# EAGLE design JackPots (EAGLE 6.6.0)
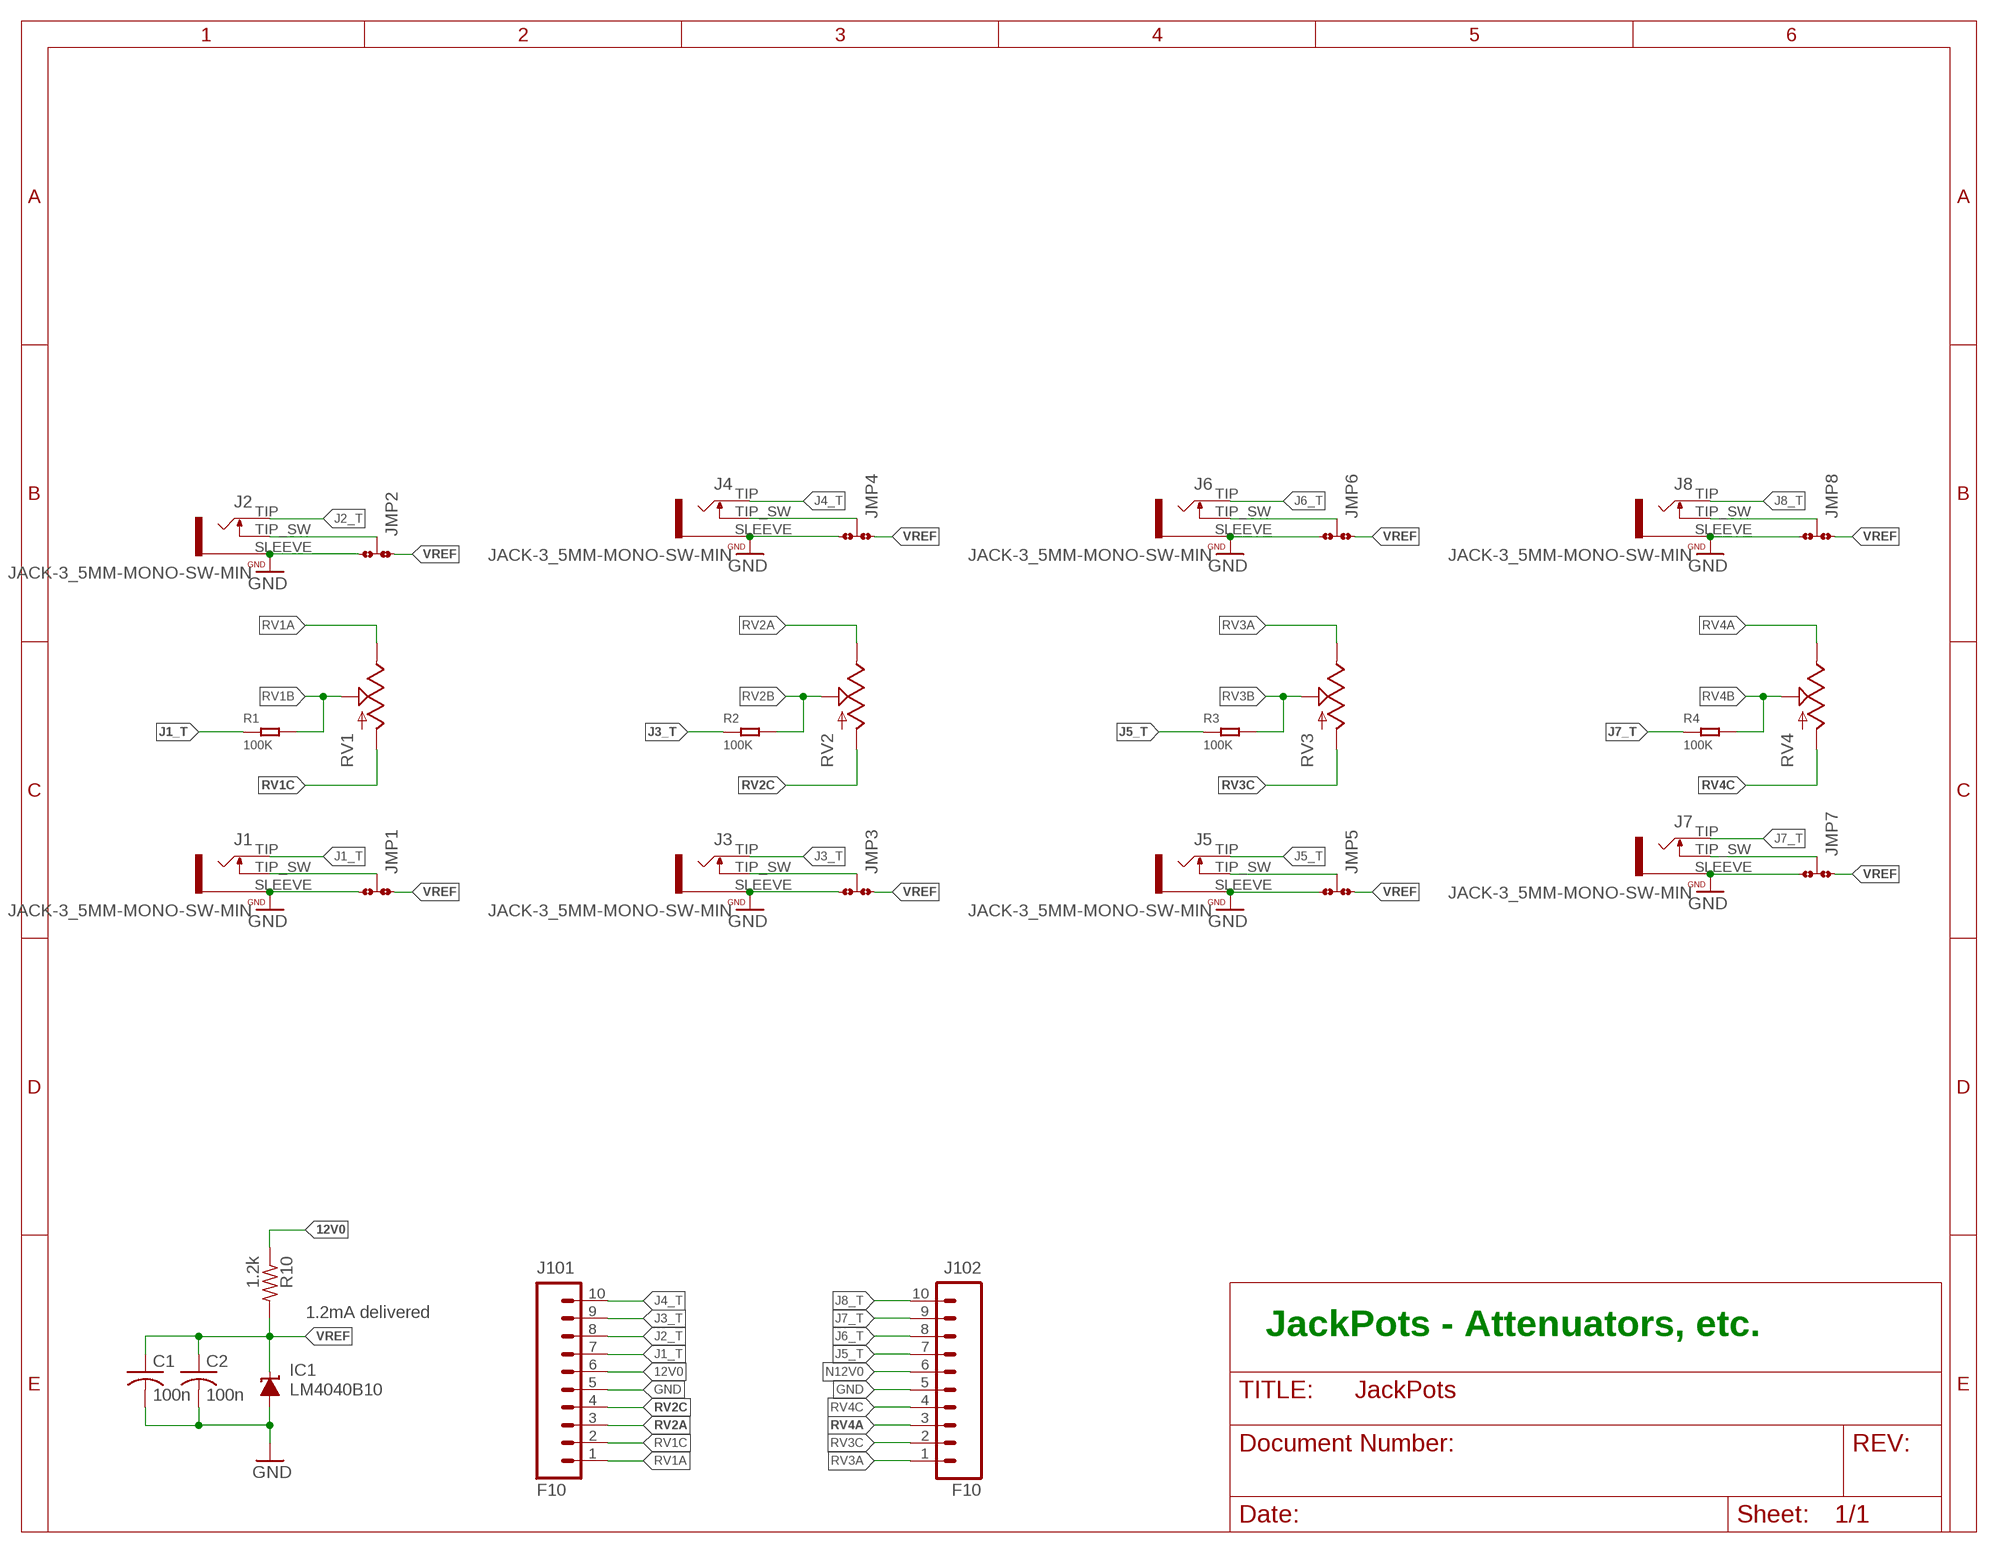
[diagram p0: schematic, sheet 1]

## Parts
C1  100n  C-USC0603  [C0603]
C2  100n  C-USC0603  [C0603]
IC1  LM4040B10  LM4041B12DBZ  [DBZ_R-PDSO-G3]
J1  JACK-3_5MM-MONO-SW-MIN  [WQP_PJ301M-MIN]
J2  JACK-3_5MM-MONO-SW-MIN  [WQP_PJ301M-MIN]
J3  JACK-3_5MM-MONO-SW-MIN  [WQP_PJ301M-MIN]
J4  JACK-3_5MM-MONO-SW-MIN  [WQP_PJ301M-MIN]
J5  JACK-3_5MM-MONO-SW-MIN  [WQP_PJ301M-MIN]
J6  JACK-3_5MM-MONO-SW-MIN  [WQP_PJ301M-MIN]
J7  JACK-3_5MM-MONO-SW-MIN  [WQP_PJ301M-MIN]
J8  JACK-3_5MM-MONO-SW-MIN  [WQP_PJ301M-MIN]
J101  F10  M10SILK_FEMALE_PTH  [1X10_OCTO]
J102  F10  M10SILK_FEMALE_PTH  [1X10_OCTO]
JMP1  JMP-3-NO-0603  [JMP-3-NO-0603]
JMP2  JMP-3-NO-0603  [JMP-3-NO-0603]
JMP3  JMP-3-NO-0603  [JMP-3-NO-0603]
JMP4  JMP-3-NO-0603  [JMP-3-NO-0603]
JMP5  JMP-3-NO-0603  [JMP-3-NO-0603]
JMP6  JMP-3-NO-0603  [JMP-3-NO-0603]
JMP7  JMP-3-NO-0603  [JMP-3-NO-0603]
JMP8  JMP-3-NO-0603  [JMP-3-NO-0603]
R1  100K  SMD-RES-100K-1%-1/10W(0603)  [R0603]
R2  100K  SMD-RES-100K-1%-1/10W(0603)  [R0603]
R3  100K  SMD-RES-100K-1%-1/10W(0603)  [R0603]
R4  100K  SMD-RES-100K-1%-1/10W(0603)  [R0603]
R10  1.2k  R-US_R0603  [R0603]
RV1  POT  [ALPS_POT]
RV2  POT  [ALPS_POT]
RV3  POT  [ALPS_POT]
RV4  POT  [ALPS_POT]

## Nets
12V0: J101.6 R10.1
GND: C1.2 C2.2 IC1.2(A) J1.SLEEVE J2.SLEEVE J3.SLEEVE J4.SLEEVE J5.SLEEVE J6.SLEEVE J7.SLEEVE J8.SLEEVE J101.5 J102.5 JMP1.3 JMP2.3 JMP3.3 JMP4.3 JMP5.3 JMP6.3 JMP7.3 JMP8.3
J1_T: J1.TIP J101.7 R1.1
J1_TN: J1.TIP_SW JMP1.2
J2_T: J2.TIP J101.8
J2_TN: J2.TIP_SW JMP2.2
J3_T: J3.TIP J101.9 R2.1
J3_TN: J3.TIP_SW JMP3.2
J4_T: J4.TIP J101.10
J4_TN: J4.TIP_SW JMP4.2
J5_T: J5.TIP J102.7 R3.1
J5_TN: J5.TIP_SW JMP5.2
J6_T: J6.TIP J102.8
J6_TN: J6.TIP_SW JMP6.2
J7_T: J7.TIP J102.9 R4.1
J7_TN: J7.TIP_SW JMP7.2
J8_T: J8.TIP J102.10
J8_TN: J8.TIP_SW JMP8.2
N12V0: J102.6
RV1A: J101.1 RV1.P$1
RV1B: R1.2 RV1.P$2
RV1C: J101.2 RV1.P$3
RV2A: J101.3 RV2.P$1
RV2B: R2.2 RV2.P$2
RV2C: J101.4 RV2.P$3
RV3A: J102.1 RV3.P$1
RV3B: R3.2 RV3.P$2
RV3C: J102.2 RV3.P$3
RV4A: J102.3 RV4.P$1
RV4B: R4.2 RV4.P$2
RV4C: J102.4 RV4.P$3
VREF: C1.1 C2.1 IC1.1(C) JMP1.1 JMP2.1 JMP3.1 JMP4.1 JMP5.1 JMP6.1 JMP7.1 JMP8.1 R10.2

## Notes on the sheet
- 1.2mA delivered
- JackPots - Attenuators, etc.

## Library data of the parts
C1 C2 = rcl:C-US: CAPACITOR, American symbol
IC1 = texas:LM4041: PRECISION MICROPOWER SHUNT VOLTAGE REFERENCE Source: http://focus.ti.com/lit/ds/slcs146e/slcs146e.pdf
J1-J8 = halcyonmod_Connectors:JACK-3_5MM-MONO-SW: Jack, 3.5mm, RIght Angle, Though-Hole
J101 J102 = oXo_Connectors:M10: Header 10 Standard 10-pin 0.1" header. Use with straight break away headers (SKU : PRT-00116), right angle break away headers (PRT-00553), swiss pins (PRT-00743), machine pins (PRT-00117), and female headers (PRT-00115).; PROD_ID: CONN-11563
JMP1-JMP8 = PatternAgents-ProtoPads:JMP-3-NO: Three Terminal Jumper - Normally Open All Pads Open (unconnected) PatternAgents ProtoPads Library Schematic and PCB layout libraries for design patterns by PatternAgents. For the CADSoft Eagle CAD program : http://www.cadsoftusa.com/download-eagle/ Source LBR : http://www.patternagents.com Github : https://github.com/PatternAgents License : http://creativecommons.org/licenses/by-sa/4.0/ (Creative Commons 4.0) THIS SOFTWARE IS PROVIDED BY THE CONTRIBUTORS "AS IS" AND WITHOUT ANY EXPRESS OR IMPLIED WARRANTIES, INCLUDING, BUT NOT LIMITED TO, THE IMPLIED WARRANTIES OF MERCHANTABILITY AND FITNESS FOR A PARTICULAR PURPOSE ARE DISCLAIMED. IN NO EVENT SHALL THE COPYRIGHT OWNER OR CONTRIBUTORS BE LIABLE FOR ANY DIRECT, INDIRECT, INCIDENTAL, SPECIAL, EXEMPLARY, OR CONSEQUENTIAL DAMAGES (INCLUDING, BUT NOT LIMITED TO, PROCUREMENT OF SUBSTITUTE GOODS OR SERVICES; LOSS OF USE, DATA, OR PROFITS; OR BUSINESS INTERRUPTION) HOWEVER CAUSED AND ON ANY THEORY OF LIABILITY, WHETHER IN CONTRACT, STRICT LIABILITY, OR TORT (INCLUDING NEGLIGENCE OR OTHERWISE) ARISING IN ANY WAY OUT OF THE USE OF THIS SOFTWARE, EVEN IF ADVISED OF THE POSSIBILITY OF SUCH DAMAGE.; BOM: EXCLUDE
R1-R4 = Seeed-Resistor-2016:SMD-RES-100K-1%-1/10W(0603): 301010196; MPN: RC0603FR-07100KL
R10 = rcl:R-US_: RESISTOR, American symbol
RV1-RV4 = halcyonmod_Potentiometers:POT; PROD_ID: RES-09177

## Board
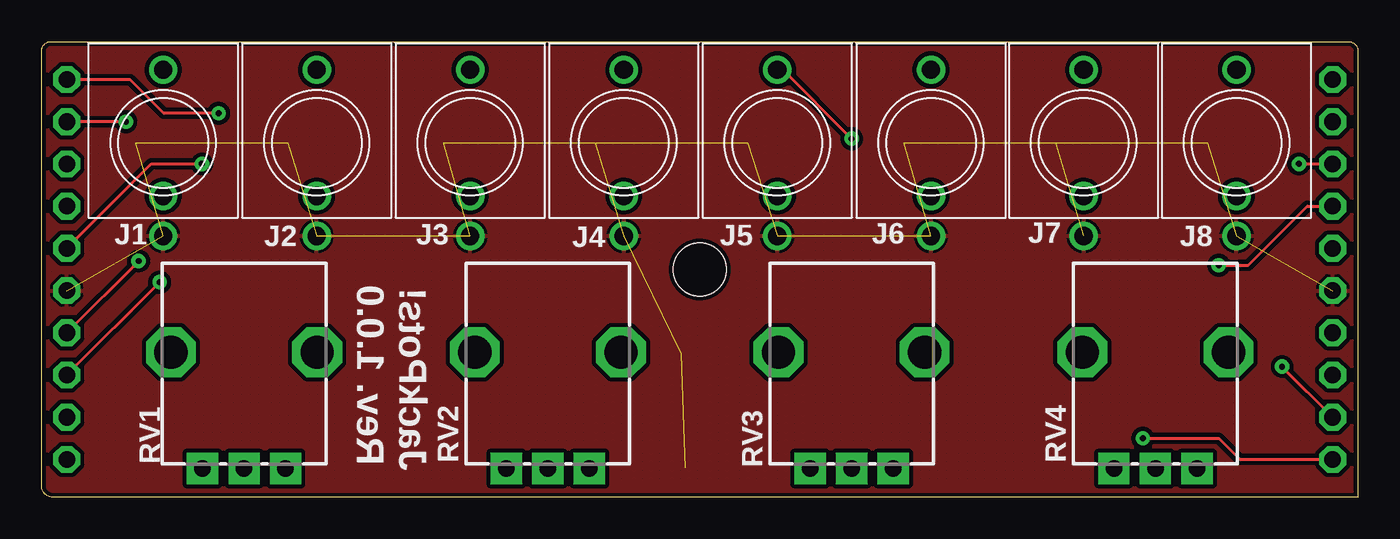
[diagram p1: board, top side]
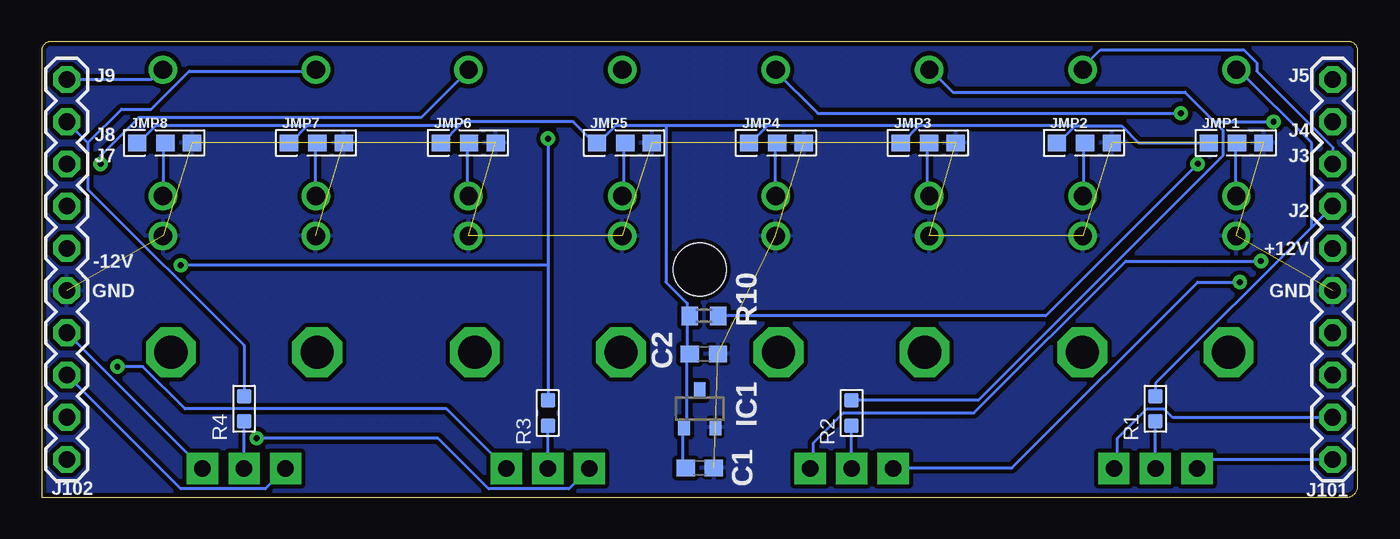
[diagram p2: board, bottom side, seen from below]

Size 79.25 x 27.43 mm. Coordinates in mm from the lower left corner, seen from the top.
Outline: 79.25,0 0.72,0 arc-90 0,0.72 0,26.86 arc-90 0.57,27.43 78.68,27.43 arc-90 79.25,26.86 79.25,0
Copper layers (1*16): Top 0.035mm / dielectric 1.5mm / Bottom 0.035mm
Design rules "PatternAgents_7mil": minimum track width 7mil, minimum drill 14mil, track to track 7mil, track to pad 7mil, pad to pad 7mil, via to via 7mil, smd to smd 7mil, copper to edge 7mil, drill to drill 7mil, minimum pad ring 12mil, minimum via ring 10mil, stop-mask expansion 4mil, vias tented up to drill 25mil, thermal gap 7mil
Holes 3.2 mm at 39.62,13.72

### Footprints (pad centres in the part's own frame; a part is rotated, then mirrored left to right if it is on the bottom)
C0603 = smd 1.1 x 1: 1 -0.85,0; 2 0.85,0
DBZ_R-PDSO-G3 = smd 0.7 x 1: 1 -0.95,-1.1; 2 0.95,-1.1; 3 0,1.1
WQP_PJ301M-MIN = drill 1.1: SLEEVE 0,-5.6; TIP 0,4.4; TIP_SW 0,-3.2
1X10_OCTO = drill 1 octagon: 1 0,0; 2 2.54,0; 3 5.08,0; 4 7.62,0; 5 10.16,0; 6 12.7,0; 7 15.24,0; 8 17.78,0; 9 20.32,0; 10 22.86,0
JMP-3-NO-0603 = smd 1.1 x 1: 1 -0.85,0; 2 0.85,0; 3 2.452,0
R0603 = smd 0.889 x 0.889: 1 0,0.762; 2 0,-0.762
R0603' = smd 1 x 1.1: 1 -0.85,0; 2 0.85,0
ALPS_POT = drill 1 pad 1.88 square: P$1 7,-2.5; P$2 7,0; P$3 7,2.5 | drill 2 octagon: P$4 0,-4.4; P$5 0,4.4

### Placement (x,y rotation side)
C1  39.62,1.78 0 bottom
C2  39.37,8.64 0 bottom
IC1  39.62,5.33 0 bottom
J1  7.32,21.34 0 top
J2  16.56,21.34 0 top
J3  25.8,21.34 0 top
J4  35.05,21.34 0 top
J5  44.29,21.34 0 top
J6  53.54,21.34 0 top
J7  62.73,21.34 0 top
J8  71.93,21.34 0 top
J101  1.52,2.29 90 bottom
J102  77.72,2.29 90 bottom
JMP1  8.13,21.34 0 bottom
JMP2  17.27,21.34 0 bottom
JMP3  26.67,21.34 0 bottom
JMP4  35.81,21.34 0 bottom
JMP5  44.96,21.34 0 bottom
JMP6  54.36,21.34 0 bottom
JMP7  63.5,21.34 0 bottom
JMP8  72.64,21.34 0 bottom
R1  12.19,5.33 0 bottom
R2  30.48,5.08 0 bottom
R3  48.77,5.08 0 bottom
R4  67.06,5.33 0 bottom
R10  1.2k  [R0603']  39.37,10.92 180 bottom
RV1  12.19,8.74 270 top
RV2  30.48,8.74 270 top
RV3  48.77,8.74 270 top
RV4  67.06,8.74 270 top

### Tracks (layer width: path | path; a pad name or v marks a point on that pad's centre or on a via)
12V0  (via drill 0.36)
  Top 0.178: v9.65,20.07 6.6,20.07 J101.6
  Bottom 0.178: R10.1 18.8,10.92 v9.65,20.07
GND  (20 unrouted)
  pour Bottom (isolate 0.254, hatched): 0,0 0,27.43 79.25,27.43 79.25,0
  pour Top (isolate 0.254, hatched): 0,0 0,27.43 79.25,27.43 79.25,0
J1_T
  Bottom 0.178: R1.1 12.19,6.86 2.79,16.26 | J101.7 2.79,16.26 | 2.79,16.26 2.79,21.34 7.11,25.65 J1.TIP
J1_TN
  Bottom 0.178: JMP1.2 7.37,21.34 7.37,18.29 J1.TIP_SW
J2_T
  Bottom 0.178: J101.8 1.52,21.08 6.1,25.65 6.1,26.16 6.86,26.92 15.49,26.92 16.51,25.91 J2.TIP
J2_TN
  Bottom 0.178: JMP2.2 16.51,21.34 16.51,18.29 J2.TIP_SW
J3_T  (via drill 0.36)
  Top 0.178: v5.08,22.61 J101.9
  Bottom 0.178: R2.1 22.86,5.84 8.13,20.57 8.13,22.1 8.64,22.61 | 8.64,22.61 10.41,24.38 24.38,24.38 25.65,25.65 J3.TIP | 8.64,22.61 v5.08,22.61
J3_TN
  Bottom 0.178: JMP3.2 25.91,21.34 25.91,18.29 J3.TIP_SW
J4_T  (via drill 0.36)
  Top 0.178: J101.10 5.33,25.15 7.37,23.11 v10.67,23.11
  Bottom 0.178: v10.67,23.11 32.51,23.11 35.05,25.65 J4.TIP
J4_TN
  Bottom 0.178: JMP4.2 35.05,21.34 35.05,18.29 J4.TIP_SW
J5_T  (via drill 0.36)
  Top 0.178: v48.77,21.59 44.45,25.91 J5.TIP | J102.7 76.2,17.53 72.64,13.97 v70.87,13.97
  Bottom 0.178: v48.77,21.59 48.77,13.97 | 48.77,13.97 R3.1 | 48.77,13.97 v70.87,13.97
J5_TN
  Bottom 0.178: JMP5.2 44.2,21.34 44.2,18.29 J5.TIP_SW
J6_T  (via drill 0.36)
  Top 0.178: v75.69,20.07 J102.8
  Bottom 0.178: v75.69,20.07 75.69,20.57 73.41,22.86 56.39,22.86 53.59,25.65 J6.TIP
J6_TN
  Bottom 0.178: JMP6.2 53.59,21.34 53.59,18.29 J6.TIP_SW
J7_T
  Bottom 0.178: R4.1 67.06,9.14 76.45,18.54 76.45,21.34 | J102.9 76.45,21.34 | 76.45,21.34 74.42,23.37 72.64,23.37 70.36,25.65 62.74,25.65 J7.TIP
J7_TN
  Bottom 0.178: JMP7.2 62.74,21.34 62.74,18.29 J7.TIP_SW
J8_T
  Bottom 0.178: J102.10 72.64,25.15 72.14,25.65 J8.TIP
J8_TN
  Bottom 0.178: JMP8.2 71.88,21.34 71.88,18.29 J8.TIP_SW
RV1A
  Bottom 0.178: J101.1 9.14,2.29 9.65,1.78 RV1.P$1
RV1B
  Bottom 0.178: RV1.P$2 R1.2
RV1C
  Bottom 0.178: J101.2 11.18,4.83 11.68,5.33 12.7,5.33 14.48,3.56 14.48,1.78 RV1.P$3
RV2A  (via drill 0.36)
  Top 0.178: v7.11,12.95 J101.3
  Bottom 0.178: v7.11,12.95 9.65,12.95 20.83,1.78 27.94,1.78 RV2.P$1
RV2B
  Bottom 0.178: RV2.P$2 R2.2
RV2C  (via drill 0.36)
  Top 0.178: v5.84,14.22 J101.4
  Bottom 0.178: v5.84,14.22 13.97,14.22 23.11,5.08 30.99,5.08 32.77,3.3 32.77,1.78 RV2.P$3
RV3A  (via drill 0.36)
  Top 0.178: J102.1 72.14,2.29 70.87,3.56 v66.29,3.56
  Bottom 0.178: v66.29,3.56 55.37,3.56 52.32,0.51 47.5,0.51 46.48,1.52 RV3.P$1
RV3B
  Bottom 0.178: RV3.P$2 R3.2
RV3C  (via drill 0.36)
  Top 0.178: v74.68,7.87 J102.2
  Bottom 0.178: v74.68,7.87 73.15,7.87 70.61,5.33 54.86,5.33 51.31,1.78 RV3.P$3
RV4A
  Bottom 0.178: J102.3 70.87,0.51 65.79,0.51 64.77,1.52 RV4.P$1
RV4B
  Bottom 0.178: RV4.P$2 R4.2
RV4C
  Bottom 0.178: J102.4 69.6,1.78 RV4.P$3
VREF
  Bottom 0.178: 40.39,10.92 40.39,8.64 | C1.1 40.64,1.78 40.64,4.06 IC1.1 40.39,4.32 40.39,8.64 | 40.39,8.64 C2.1 | JMP1.1 13.21,21.34 14.22,22.35 17.02,22.35 | 17.02,22.35 18.03,21.34 JMP2.1 | 26.42,22.35 27.43,21.34 JMP3.1 | 17.02,22.35 26.42,22.35 | 35.56,22.35 36.58,21.34 JMP4.1 | 26.42,22.35 35.56,22.35 | 35.56,22.35 41.66,22.35 | 41.66,22.35 44.7,22.35 45.72,21.34 JMP5.1 45.97,21.34 47.24,22.61 53.85,22.61 54.1,22.35 | 54.1,22.35 55.12,21.34 JMP6.1 | 63.25,22.35 64.26,21.34 JMP7.1 | 54.1,22.35 63.25,22.35 | 63.25,22.35 72.39,22.35 73.41,21.34 JMP8.1 | 40.39,10.92 40.39,11.68 41.66,12.95 41.66,22.35 | 40.39,10.92 R10.2

### Text on the board
tPlace: Rev. 1.0.0 | JackPots!
bPlace: J5 | J9 | J4 | J8 | J3 | J7 | J2 | +12V | -12V | GND | GND